# EAGLE design Switch panel (EAGLE 7.2.0)
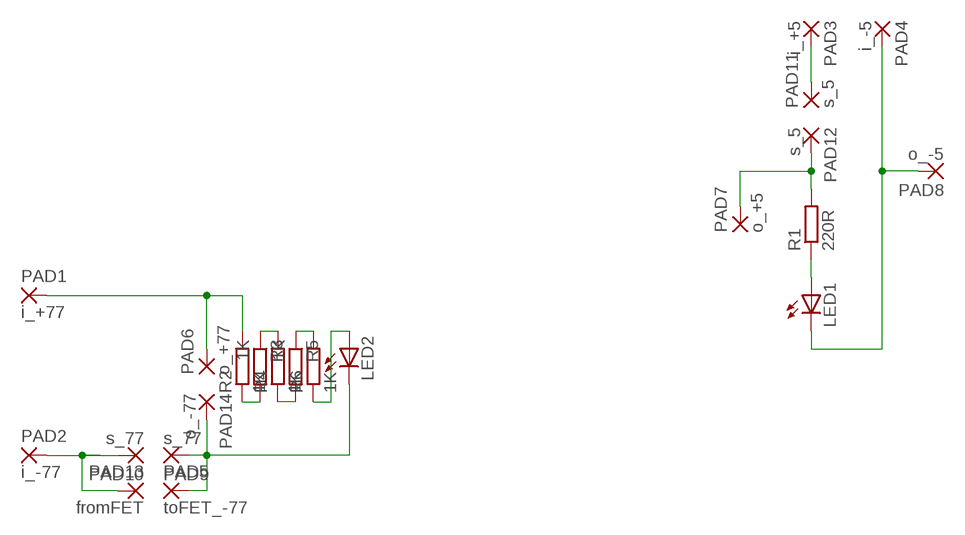
[diagram p0: schematic, sheet 1]

## Parts
LED1  LED3MM  [LED3MM]
LED2  LED3MM  [LED3MM]
PAD1  i_+77  WIREPADSMD2,54-5,08  [SMD2,54-5,08]
PAD2  i_-77  WIREPADSMD2,54-5,08  [SMD2,54-5,08]
PAD3  i_+5  WIREPADSMD2,54-5,08  [SMD2,54-5,08]
PAD4  i_-5  WIREPADSMD2,54-5,08  [SMD2,54-5,08]
PAD5  toFET_-77  WIREPADSMD2,54-5,08  [SMD2,54-5,08]
PAD6  o_+77  WIREPADSMD2,54-5,08  [SMD2,54-5,08]
PAD7  o_+5  WIREPADSMD2,54-5,08  [SMD2,54-5,08]
PAD8  o_-5  WIREPADSMD2,54-5,08  [SMD2,54-5,08]
PAD9  s_77  WIREPADSMD2,54-5,08  [SMD2,54-5,08]
PAD10  s_77  WIREPADSMD2,54-5,08  [SMD2,54-5,08]
PAD11  s_5  WIREPADSMD2,54-5,08  [SMD2,54-5,08]
PAD12  s_5  WIREPADSMD2,54-5,08  [SMD2,54-5,08]
PAD13  fromFET  WIREPADSMD2,54-5,08  [SMD2,54-5,08]
PAD14  o_-77  WIREPADSMD2,54-5,08  [SMD2,54-5,08]
R1  220R  R-EU_R1206  [R1206]
R2  1K  R-EU_R1206  [R1206]
R3  1K  R-EU_R1206  [R1206]
R4  1K  R-EU_R1206  [R1206]
R5  1K  R-EU_R1206  [R1206]
R6  1K  R-EU_R1206  [R1206]

## Nets
N$1: PAD7.1(P) PAD12.1(P) R1.2
N$2: LED1.A R1.1
N$3: LED1.K(C) PAD4.1(P) PAD8.1(P)
N$4: PAD3.1(P) PAD11.1(P)
N$5: R2.1 R3.2
N$6: R3.1 R4.2
N$7: R4.1 R5.2
N$8: R5.1 R6.2
N$9: PAD1.1(P) PAD6.1(P) R2.2
N$10: LED2.A R6.1
N$11: LED2.K(C) PAD5.1(P) PAD9.1(P) PAD14.1(P)
N$12: PAD2.1(P) PAD10.1(P) PAD13.1(P)

## Library data of the parts
LED1 LED2 = led:LED: LED OSRAM: - CHIPLED LG R971, LG N971, LY N971, LG Q971, LY Q971, LO R971, LY R971 LH N974, LH R974 LS Q976, LO Q976, LY Q976 LO Q996 - Hyper CHIPLED LW Q18S LB Q993, LB Q99A, LB R99A - SideLED LS A670, LO A670, LY A670, LG A670, LP A670 LB A673, LV A673, LT A673, LW A673 LH A674 LY A675 LS A676, LA A676, LO A676, LY A676, LW A676 LS A679, LY A679, LG A679 - Hyper Micro SIDELED® LS Y876, LA Y876, LO Y876, LY Y876 LT Y87S - SmartLED LW L88C, LW L88S LB L89C, LB L89S, LG L890 LS L89K, LO L89K, LY L89K LS L896, LA L896, LO L896, LY L896 - TOPLED LS T670, LO T670, LY T670, LG T670, LP T670 LSG T670, LSP T670, LSY T670, LOP T670, LYG T670 LG T671, LOG T671, LSG T671 LB T673, LV T673, LT T673, LW T673 LH T674 LS T676, LA T676, LO T676, LY T676, LB T676, LH T676, LSB T676, LW T676 LB T67C, LV T67C, LT T67C, LS T67K, LO T67K, LY T67K, LW E67C LS E67B, LA E67B, LO E67B, LY E67B, LB E67C, LV E67C, LT E67C LW T67C LS T679, LY T679, LG T679 LS T770, LO T770, LY T770, LG T770, LP T770 LB T773, LV T773, LT T773, LW T773 LH T774 LS E675, LA E675, LY E675, LS T675 LS T776, LA T776, LO T776, LY T776, LB T776 LHGB T686 LT T68C, LB T68C - Hyper Mini TOPLED® LB M676 - Mini TOPLED Santana® LG M470 LS M47K, LO M47K, LY M47K Source: http://www.osram.convergy.de LUXEON: - LUMILED® LXK2-PW12-R00, LXK2-PW12-S00, LXK2-PW14-U00, LXK2-PW14-V00 LXK2-PM12-R00, LXK2-PM12-S00, LXK2-PM14-U00 LXK2-PE12-Q00, LXK2-PE12-R00, LXK2-PE12-S00, LXK2-PE14-T00, LXK2-PE14-U00 LXK2-PB12-K00, LXK2-PB12-L00, LXK2-PB12-M00, LXK2-PB14-N00, LXK2-PB14-P00, LXK2-PB14-Q00 LXK2-PR12-L00, LXK2-PR12-M00, LXK2-PR14-Q00, LXK2-PR14-R00 LXK2-PD12-Q00, LXK2-PD12-R00, LXK2-PD12-S00 LXK2-PH12-R00, LXK2-PH12-S00 LXK2-PL12-P00, LXK2-PL12-Q00, LXK2-PL12-R00 Source: www.luxeon.com KINGBRIGHT: KA-3528ASYC Source: www.kingbright.com
PAD1-PAD14 = wirepad:WIREPAD: Wire PAD connect wire on PCB
R1-R6 = rcl:R-EU_: RESISTOR, European symbol

## Board
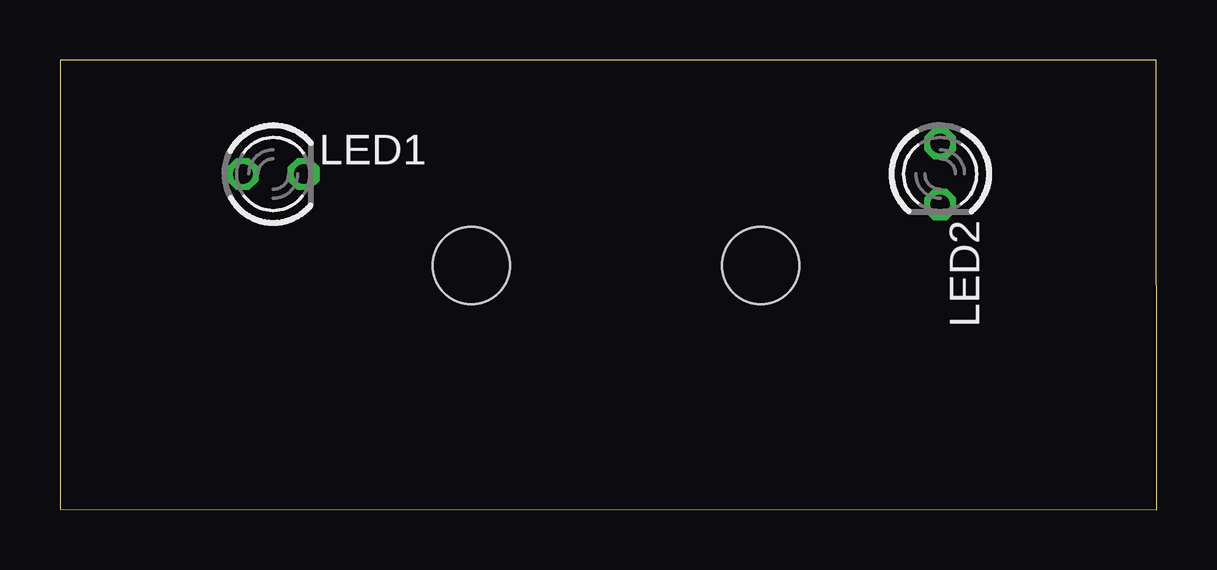
[diagram p1: board, top side]
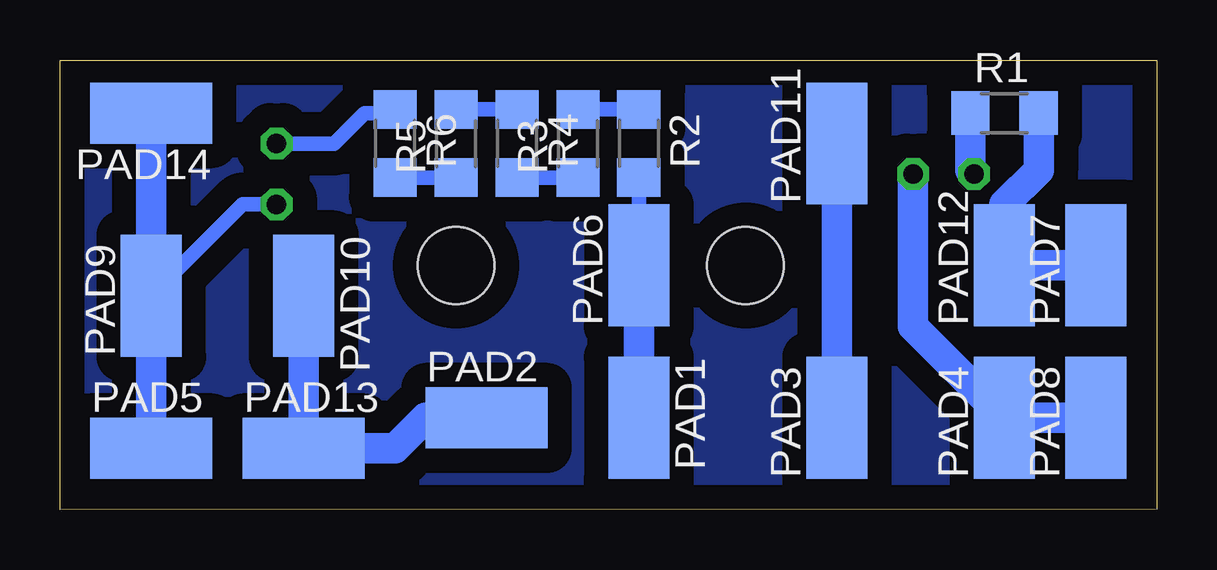
[diagram p2: board, bottom side, seen from below]

Size 45.72 x 18.74 mm. Coordinates in mm from the lower left corner, seen from the top.
Outline: 0,0.02 45.72,0 45.7,18.74 0,18.74 0,0.02
Copper layers (1*16): Top 0.035mm / dielectric 1.5mm / Bottom 0.035mm
Design rules "default": minimum track width 10mil, minimum drill 24mil, track to track 8mil, track to pad 8mil, pad to pad 8mil, via to via 8mil, smd to smd 8mil, copper to edge 40mil, drill to drill 8mil, minimum pad ring 10mil, minimum via ring 8mil, stop-mask expansion 4mil, vias tented up to drill 0mil, thermal gap 10mil
Holes 3.2 mm at 17.14,10.18 29.21,10.18

### Footprints (pad centres in the part's own frame; a part is rotated, then mirrored left to right if it is on the bottom)
LED3MM = drill 0.813 octagon: A -1.27,0; K 1.27,0
SMD2,54-5,08 = smd 2.54 x 5.08: 1 0,0
R1206 = smd 1.6 x 1.803: 1 -1.422,0; 2 1.422,0

### Placement (x,y rotation side)
LED1  8.89,13.99 0 top
LED2  36.69,13.99 270 top
PAD1  21.59,3.83 180 bottom
PAD2  27.94,3.83 270 bottom
PAD3  13.34,3.83 0 bottom
PAD4  6.35,3.83 0 bottom
PAD5  41.91,2.56 270 bottom
PAD6  21.59,10.18 0 bottom
PAD7  2.54,10.18 0 bottom
PAD8  2.54,3.83 0 bottom
PAD9  41.91,8.91 0 bottom
PAD10  35.56,8.91 180 bottom
PAD11  13.34,15.26 0 bottom
PAD12  6.35,10.18 0 bottom
PAD13  35.56,2.56 270 bottom
PAD14  41.91,16.53 90 bottom
R1  6.35,16.53 0 bottom
R2  21.59,15.26 270 bottom
R3  24.13,15.26 90 bottom
R4  26.67,15.26 270 bottom
R5  29.21,15.26 90 bottom
R6  31.75,15.26 270 bottom

### Tracks (layer width: path | path; a pad name or v marks a point on that pad's centre or on a via)
N$1
  Bottom 1.27: R1.2 4.93,14.14 6.35,12.72 PAD12.1 PAD7.1
N$2
  Bottom 1.27: R1.1 7.77,14.14 LED1.A
N$3
  Bottom 1.27: LED1.K 10.16,7.64 PAD4.1 PAD8.1
N$4
  Bottom 1.27: PAD3.1 PAD11.1
N$5
  Bottom 0.61: R2.1 R3.2
N$6
  Bottom 0.61: R3.1 R4.2
N$7
  Bottom 0.61: R4.1 R5.2
N$8
  Bottom 0.61: R5.1 R6.2
N$9
  Bottom 0.61: PAD6.1 R2.2
  Bottom 1.27: PAD1.1 PAD6.1
N$10
  Bottom 0.61: LED2.A 34.29,15.26 33.02,16.53 31.9,16.53 R6.1
N$11
  Bottom 0.61: LED2.K 38.1,12.72 PAD9.1
  Bottom 1.27: PAD5.1 PAD9.1 PAD14.1
N$12
  Bottom 1.27: PAD10.1 PAD13.1 31.75,2.56 30.48,3.83 PAD2.1
N$13
  pour Bottom (isolate 1.016): 0,19.07 45.72,19.07 45.72,0.02 0,0.02